# EAGLE design EFM_VCF3 (EAGLE 7.6.0)
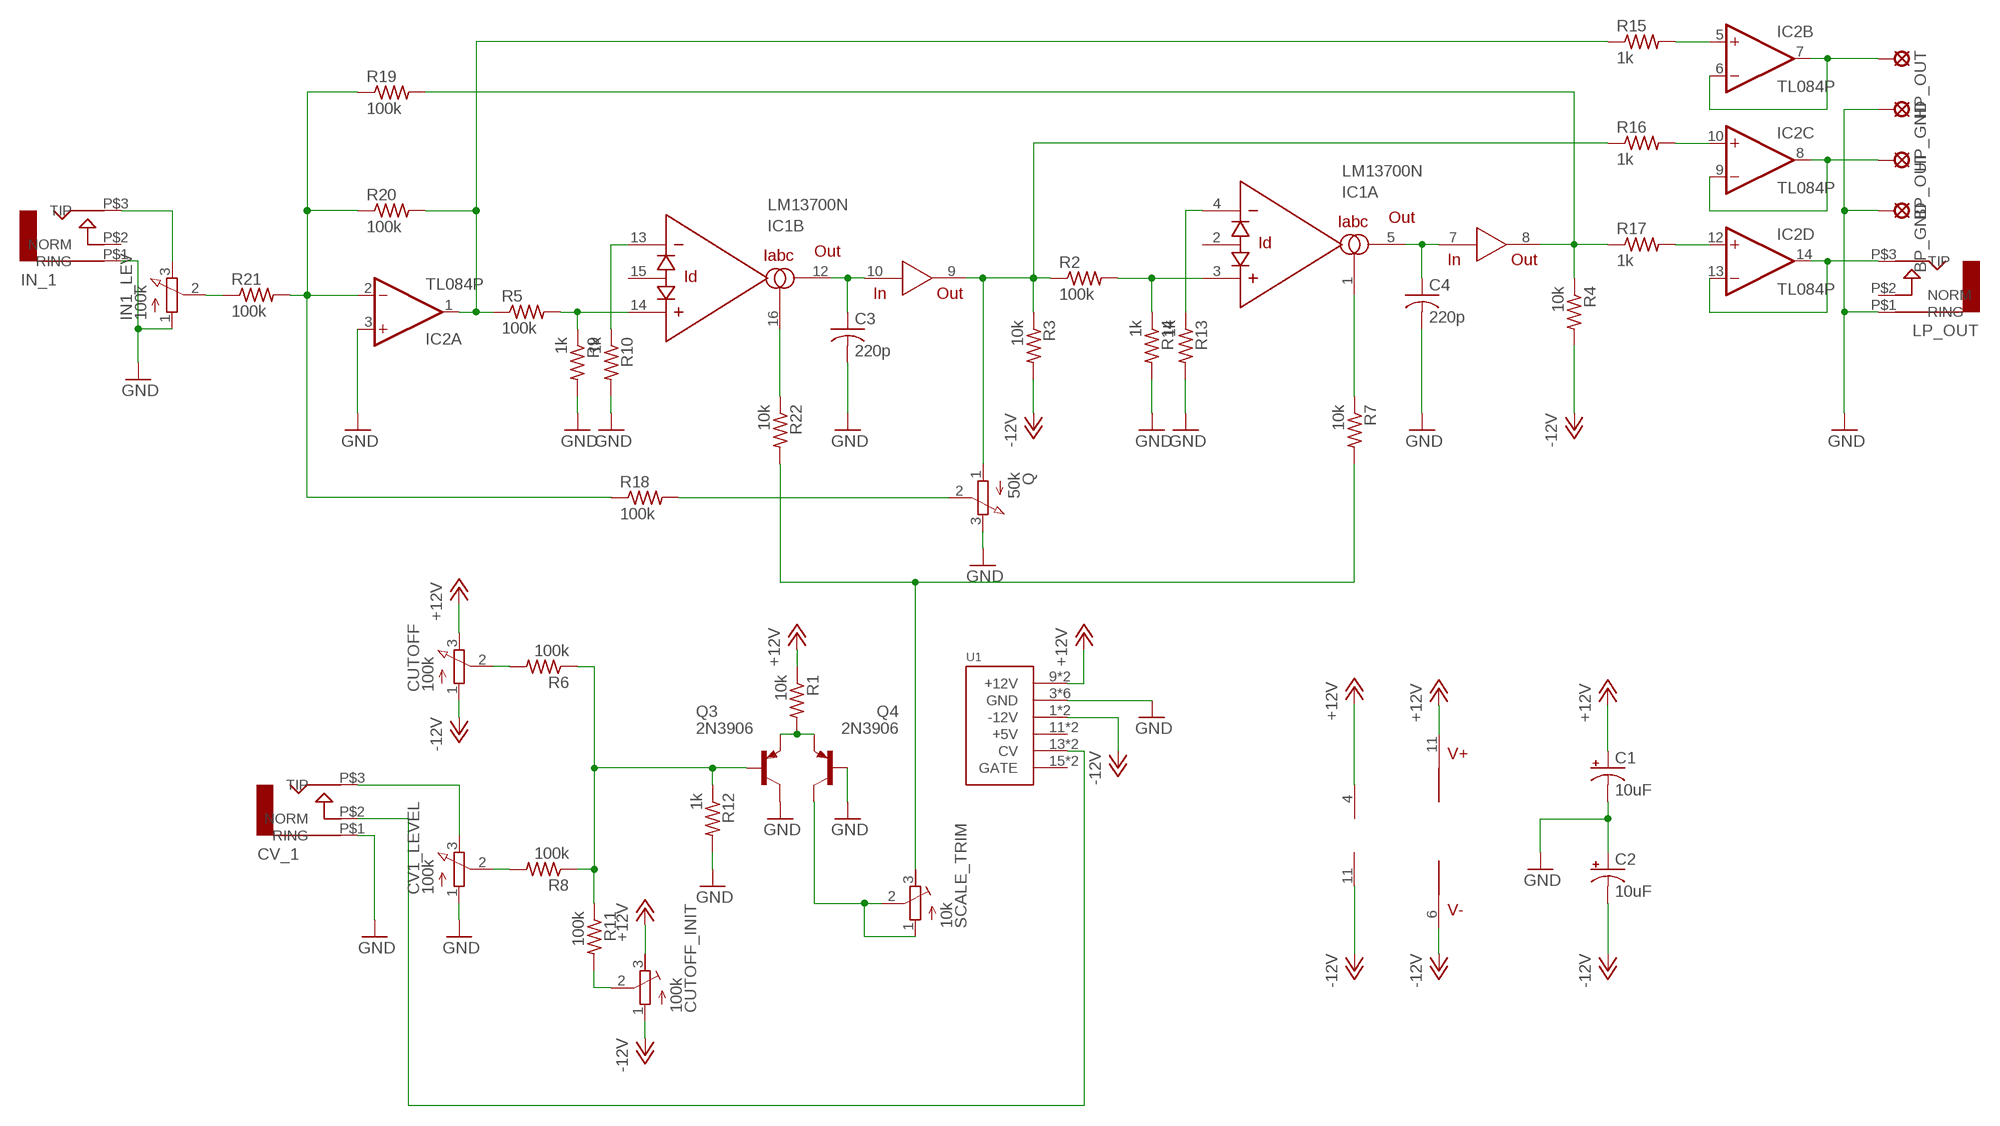
[diagram p0: schematic, sheet 1]

## Parts
BP_GND  LSP10  [LSP10]
BP_OUT  LSP10  [LSP10]
C1  10uF  CPOL-USB45181A  [B45181A]
C2  10uF  CPOL-USB45181A  [B45181A]
C3  220p  C-US075-032X103  [C075-032X103]
C4  220p  C-US075-032X103  [C075-032X103]
CUTOFF  100k  3RP/1610N  [3RP/1610N]
CUTOFF_INIT  100k  R-TRIMM64W  [RTRIM64W]
CV1_LEVEL  100k  3RP/1610N  [3RP/1610N]
CV_1  AUDIO-JACK  [ERTHENVAR-JACK-90DEG]
HP_GND  LSP10  [LSP10]
HP_OUT  LSP10  [LSP10]
IC1  LM13700N  [DIL16]
IC2  TL084P  [DIL14]
IN1_LEV  100k  3RP/1610N  [3RP/1610N]
IN_1  AUDIO-JACK  [ERTHENVAR-JACK-90DEG]
LP_OUT  AUDIO-JACK  [ERTHENVAR-JACK-90DEG]
Q  50k  3RP/1610N  [3RP/1610N]
Q3  2N3906  [TO92]
Q4  2N3906  [TO92]
R1  10k  R-US_0207/7  [0207/7]
R2  100k  R-US_0207/7  [0207/7]
R3  10k  R-US_0207/7  [0207/7]
R4  10k  R-US_0207/7  [0207/7]
R5  100k  R-US_0207/7  [0207/7]
R6  100k  R-US_0207/7  [0207/7]
R7  10k  R-US_0207/7  [0207/7]
R8  100k  R-US_0207/7  [0207/7]
R9  1k  R-US_0207/7  [0207/7]
R10  1k  R-US_0207/7  [0207/7]
R11  100k  R-US_0207/7  [0207/7]
R12  1k  R-US_0207/7  [0207/7]
R13  1k  R-US_0207/7  [0207/7]
R14  1k  R-US_0207/7  [0207/7]
R15  1k  R-US_0207/7  [0207/7]
R16  1k  R-US_0207/7  [0207/7]
R17  1k  R-US_0207/7  [0207/7]
R18  100k  R-US_0207/7  [0207/7]
R19  100k  R-US_0207/7  [0207/7]
R20  100k  R-US_0207/7  [0207/7]
R21  100k  R-US_0207/7  [0207/7]
R22  10k  R-US_0309/10  [0309/10]
SCALE_TRIM  10k  R-TRIMM64W  [RTRIM64W]
U1  POWER  [POWER_16]

## Nets
+12V: C1.+ CUTOFF.3(E) CUTOFF_INIT.3(E) IC1.11(V+) IC2.4(P:V+) R1.1 U1.9(+12V) U1.10(+12V)
-12V: C2.- CUTOFF.1(A) CUTOFF_INIT.1(A) IC1.6(V-) IC2.11(P:V-) R3.2 R4.2 U1.1(-12V) U1.2(-12V)
GND: BP_GND.MP C1.- C2.+ C3.2 C4.2 CV1_LEVEL.1(A) CV_1.P$1(RING) HP_GND.MP IC2.3(A:+IN) IN1_LEV.1(A) IN_1.P$1(RING) LP_OUT.P$1(RING) Q3.1(C) Q4.2(B) Q.3(E) R9.2 R10.2 R12.2 R13.2 R14.2 U1.3(GND) U1.4(GND) U1.5(GND) U1.6(GND) U1.7(GND) U1.8(GND)
N$1: Q3.3(E) Q4.3(E) R1.2
N$2: C3.1 IC1.10(IN) IC1.12(B:OUT)
N$3: C4.1 IC1.5(A:OUT) IC1.7(IN)
N$4: IC1.14(B:+IN) R5.2 R9.1
N$5: IC1.9(OUT) Q.1(A) R2.1 R3.1 R16.1
N$6: IC1.3(A:+IN) R2.2 R14.1
N$7: IC1.13(B:-IN) R10.1
N$8: IC1.4(A:-IN) R13.1
N$9: IC2.1(A:OUT) R5.1 R15.1 R20.2
N$10: CV1_LEVEL.2(S) R8.2
N$11: IC2.5(B:+IN) R15.2
N$12: IC2.10(C:+IN) R16.2
N$13: IC2.12(D:+IN) R17.2
N$14: IC2.13(D:-IN) IC2.14(D:OUT) LP_OUT.P$3(TIP)
N$15: BP_OUT.MP IC2.8(C:OUT) IC2.9(C:-IN)
N$16: IC1.1(A:IABC) R7.1
N$17: HP_OUT.MP IC2.6(B:-IN) IC2.7(B:OUT)
N$18: Q3.2(B) R6.1 R8.1 R11.1 R12.1
N$19: Q.2(S) R18.2
N$20: IC1.16(B:IABC) R22.1
N$21: R7.2 R22.2 SCALE_TRIM.3(E)
N$22: IN1_LEV.3(E) IN_1.P$3(TIP)
N$23: IC1.8(OUT) R4.1 R17.1 R19.2
N$24: IN1_LEV.2(S) R21.1
N$25: Q4.1(C) SCALE_TRIM.1(A) SCALE_TRIM.2(S)
N$26: IC2.2(A:-IN) R18.1 R19.1 R20.1 R21.2
N$27: CUTOFF_INIT.2(S) R11.2
N$54: CV1_LEVEL.3(E) CV_1.P$3(TIP)
N$55: CV_1.P$2(NORM) U1.13(CV) U1.14(CV)
N$56: CUTOFF.2(S) R6.2
Unconnected: IC1.2(A:ID) IC1.15(B:ID) IN_1.P$2(NORM) LP_OUT.P$2(NORM) U1.11(+5V) U1.12(+5V) U1.15(GATE) U1.16(GATE)

## Library data of the parts
BP_GND BP_OUT HP_GND HP_OUT = solpad:LSP10: SOLDER PAD drill 1.0 mm, distributor Buerklin, 12H555
C1 C2 = rcl:CPOL-US: POLARIZED CAPACITOR, American symbol
C3 C4 = rcl:C-US: CAPACITOR, American symbol
CUTOFF CV1_LEVEL IN1_LEV Q = pot:3RP/1610N: 16mm Potentiometer one level Source: http://www.alphapotentiometers.net/html/16mm_pot_2.html
CUTOFF_INIT SCALE_TRIM = rcl:R-TRIMM: Trimm resistor
CV_1 IN_1 LP_OUT = erthenvar:AUDIO-JACK: Switching Mono 3.5mm Audio Jack from Erthenvar.
IC1 = synthdiy updated imperial:LM13700: National Dual OTA with buffers.
IC2 = linear:TL084: OP AMP
Q3 Q4 = transistor-pnp:2N3906: PNP Transistor
R1-R22 = rcl:R-US_: RESISTOR, American symbol
U1 = eurorack:POWER

## Board
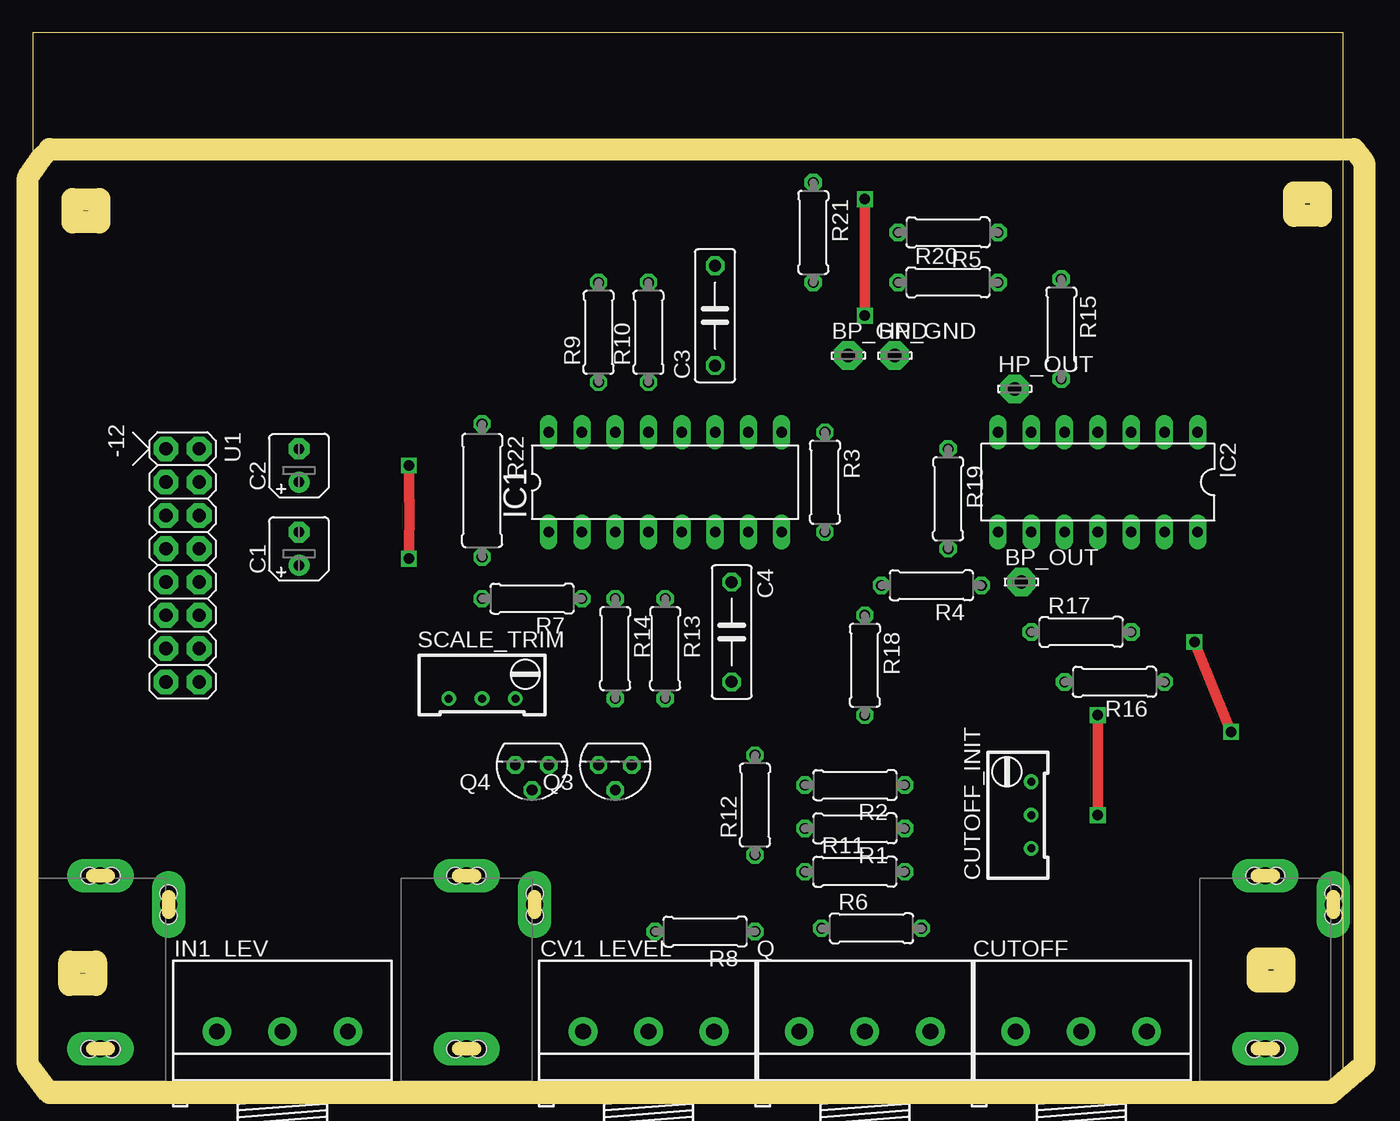
[diagram p1: board, top side]
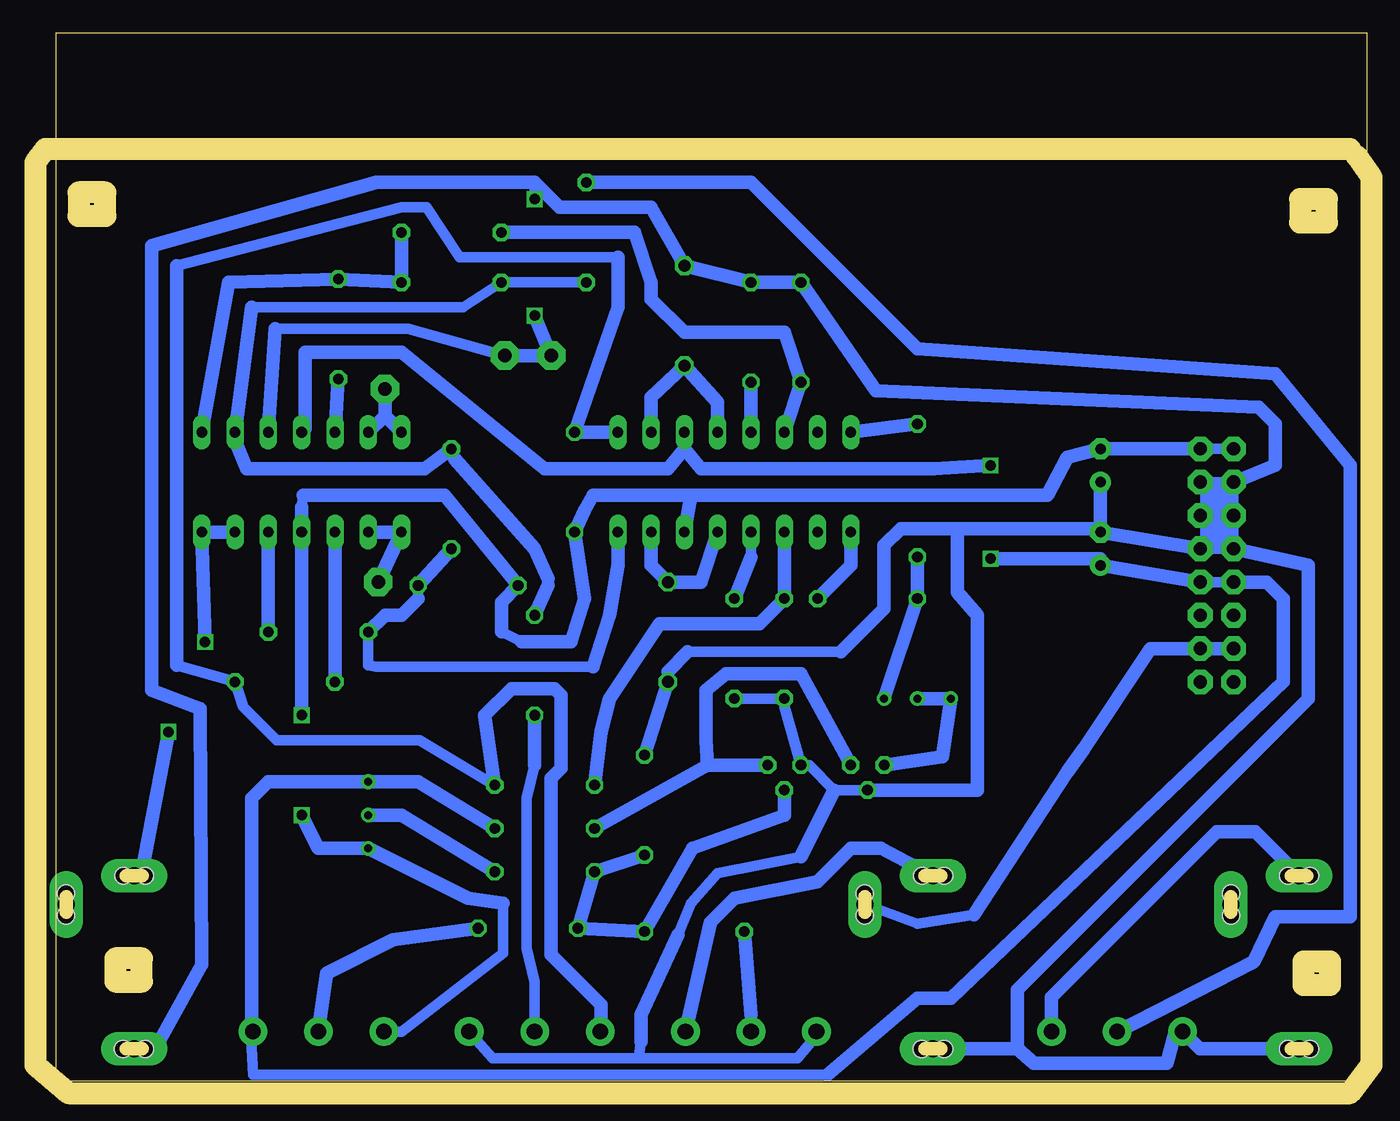
[diagram p2: board, bottom side, seen from below]

Size 100 x 80 mm. Coordinates in mm from the lower left corner, seen from the top.
Outline: 0,0 100,0 100,80 0,80 0,0
Copper layers (1*16): Top 0.035mm / dielectric 1.5mm / Bottom 0.035mm
Design rules "default *": minimum track width 28mil, minimum drill 31mil, track to track 16mil, track to pad 16mil, pad to pad 16mil, via to via 16mil, smd to smd 8mil, copper to edge 0mil, drill to drill 16mil, minimum pad ring 10mil, minimum via ring 8mil, stop-mask expansion 4mil, vias tented up to drill 0mil, thermal gap 10mil
Milling: 24 lines

### Footprints (pad centres in the part's own frame; a part is rotated, then mirrored left to right if it is on the bottom)
LSP10 = drill 1.016 pad 2.159 octagon: MP 0,0
B45181A = drill 0.813 pad 1.6: + -1.27,0 | drill 0.813 pad 1.6 octagon: - 1.27,0
C075-032X103 = drill 0.914 octagon: 1 -3.81,0; 2 3.81,0
3RP/1610N = drill 1.2 pad 2.184: 1 -5,0; 2 0,0; 3 5,0
RTRIM64W = drill 0.61: 1 1.27,-2.54; 2 1.27,0; 3 1.27,2.54
ERTHENVAR-JACK-90DEG = drill 1.3 pad 2.54 long: P$1 5,-2.5; P$2 -0.2,-13.5; P$3 5,-15.7 | hole 1.3: 5.842,-2.489; 4.14,-2.489; -0.203,-12.649; -0.203,-14.351; 5.842,-15.697; 4.166,-15.697
DIL16 = drill 0.813 long: 1 -8.89,-3.81; 2 -6.35,-3.81; 3 -3.81,-3.81; 4 -1.27,-3.81; 5 1.27,-3.81; 6 3.81,-3.81; 7 6.35,-3.81; 8 8.89,-3.81; 9 8.89,3.81; 10 6.35,3.81; 11 3.81,3.81; 12 1.27,3.81; 13 -1.27,3.81; 14 -3.81,3.81; 15 -6.35,3.81; 16 -8.89,3.81
DIL14 = drill 0.813 long: 1 -7.62,-3.81; 2 -5.08,-3.81; 3 -2.54,-3.81; 4 0,-3.81; 5 2.54,-3.81; 6 5.08,-3.81; 7 7.62,-3.81; 8 7.62,3.81; 9 5.08,3.81; 10 2.54,3.81; 11 0,3.81; 12 -2.54,3.81; 13 -5.08,3.81; 14 -7.62,3.81
TO92 = drill 0.813 octagon: 1 1.27,0; 2 0,1.905; 3 -1.27,0
0207/7 = drill 0.813 octagon: 1 -3.81,0; 2 3.81,0
0309/10 = drill 0.813 octagon: 1 -5.08,0; 2 5.08,0
POWER_16 = drill 1.016 pad 1.88 octagon: 1 -6.35,-1.27; 2 -6.35,1.27; 3 -3.81,-1.27; 4 -3.81,1.27; 5 -1.27,-1.27; 6 -1.27,1.27; 7 1.27,-1.27; 8 1.27,1.27; 9 3.81,-1.27; 10 3.81,1.27; 11 6.35,-1.27; 12 6.35,1.27; 13 8.89,-1.27; 14 8.89,1.27; 15 11.43,-1.27; 16 11.43,1.27

### Placement (x,y rotation side)
BP_GND  62.23,55.37 0 top
BP_OUT  75.44,38.1 0 top
C1  20.32,40.64 90 top
C2  20.32,46.99 90 top
C3  52.07,58.42 90 top
C4  53.34,34.29 270 top
CUTOFF  80.01,3.81 0 top
CUTOFF_INIT  74.93,20.32 0 top
CV1_LEVEL  46.99,3.81 0 top
CV_1  38.1,0 180 top
HP_GND  65.79,55.37 0 top
HP_OUT  74.93,52.83 0 top
IC1  48.26,45.72 0 top
IC2  81.28,45.72 180 top
IN1_LEV  19.05,3.81 0 top
IN_1  10.16,0 180 top
LP_OUT  99.06,0 180 top
Q  63.5,3.81 0 top
Q3  44.45,24.13 180 top
Q4  38.1,24.13 180 top
R1  62.74,19.3 180 top
R2  62.74,22.61 180 top
R3  60.45,45.72 270 top
R4  68.58,37.85 180 top
R5  69.85,64.77 180 top
R6  64.01,11.68 0 top
R7  38.1,36.83 180 top
R8  51.31,11.43 180 top
R9  43.18,57.15 90 top
R10  46.99,57.15 90 top
R11  62.74,16 0 top
R12  55.12,21.08 90 top
R13  48.26,33.02 270 top
R14  44.45,33.02 270 top
R15  78.49,57.4 270 top
R16  82.55,30.48 180 top
R17  80.01,34.29 0 top
R18  63.5,31.75 270 top
R19  69.85,44.45 270 top
R20  69.85,60.96 0 top
R21  59.56,64.77 270 top
R22  34.29,45.09 270 top
SCALE_TRIM  34.29,30.48 270 top
U1  11.43,41.91 270 top

### Tracks (layer width: path | path; a pad name or v marks a point on that pad's centre or on a via)
+12V  (via drill 0.8)
  Top 0.813: v28.7,39.88 28.74,44.26 28.7,44.29 v28.7,46.99
  Bottom 0.813: 85.09,3.89 CUTOFF.3 85.09,3.73 85.09,2.54 84.96,0.51 41.15,0.51 | U1.9 U1.10 | C1.+ 20.32,39.88 | 81.03,49.78 IC2.4 | IC1.11 52.07,48.26
  Bottom 1.016: R1.1 72.39,22.86 CUTOFF_INIT.3 83.82,22.86 85.09,21.59 85.09,3.89 | U1.10 C1.+ | 41.15,0.51 34.29,6.35 31.75,6.35 6.35,30.48 6.35,36.83 7.62,38.1 U1.9 | v28.7,39.88 20.32,39.88 | 81.03,49.78 81.03,55.63 73.66,55.63 62.74,46.74 53.34,46.74 52.07,48.26 50.8,46.74 33.02,46.74 v28.7,46.99
-12V  (via drill 0.8)
  Top 0.813: v81.28,20.32 v81.28,27.94
  Bottom 0.813: U1.1 U1.2 | 66.04,34.29 64.52,33.53 | 81.15,44.7 81.28,43.81 | 75.01,3.73 CUTOFF.1 73.66,3.81 65.91,9.78 65.91,13.59
  Bottom 1.016: U1.2 C2.- 22.86,47.62 24.38,44.7 51.56,44.7 | 51.56,44.7 IC1.6 | 51.56,44.7 59.05,44.7 59.69,43.56 R3.2 59.69,36.83 60.71,33.53 64.52,33.53 | 81.15,44.7 70.36,44.7 R4.2 66.04,36.58 66.04,34.29 | 81.28,43.81 IC2.11 v81.28,27.94 | 65.91,13.59 68.58,13.97 CUTOFF_INIT.1 80.01,17.78 v81.28,20.32
GND  (via drill 0.8)  (1 unrouted)
  Top 0.813: v63.5,58.42 v63.5,67.31
  Bottom 0.711: 44.45,28.57 R14.2 | U1.7 U1.5 U1.3 | 14.61,3.81 IN1_LEV.1
  Bottom 0.813: R13.2 R14.2 | 42.55,3.81 CV1_LEVEL.1 41.99,3.48 43.43,1.78 54.8,1.78 55.57,1.78 | HP_GND.MP 73.15,57.4 83.31,57.4 | U1.4 U1.3 | U1.7 U1.8 | U1.5 U1.6 | 44.45,28.57 Q3.1 42.55,24.13 40.64,22.23 Q4.2 | 32.98,2.5 33.02,2.54 | LP_OUT.P$1 94.06,2.62 92.08,3.17 | 43.18,17.14 49.53,15.88 51.56,13.59 52.58,11.18 | 55.37,3.05 55.57,1.78 | 55.57,1.78 56.39,1.78 66.72,1.78 Q.3 | C4.2 53.34,31.24 | 51.82,32.77 40.13,32.77 | v63.5,67.31 63.5,68.58 | 20.57,42.16 C1.-
  Bottom 1.016: C4.2 R12.2 | C2.+ C1.- U1.8 | 83.31,57.4 IC2.3 | HP_GND.MP BP_GND.MP v63.5,58.42 | 14.61,3.81 15.24,1.4 25.4,1.4 26.67,2.5 | 26.67,2.5 26.67,6.99 4.45,29.21 4.45,39.37 U1.7 | U1.3 6.99,46.99 6.99,50.16 8.26,51.44 37.47,52.7 R9.2 R10.2 C3.2 54.61,66.67 61.59,66.67 63.5,68.58 75.56,68.58 92.71,63.75 92.71,29.84 89.03,28.45 88.9,8.89 92.08,3.17 | IN_1.P$1 12.74,2.5 IN1_LEV.1 | 26.67,2.5 32.98,2.5 | Q4.2 29.72,22.23 29.72,35.56 31.24,37.34 31.24,42.16 | 43.18,17.14 40.64,22.23 | 52.58,11.18 55.37,5.08 55.37,3.05 | 53.34,31.24 51.82,32.77 | 40.13,32.77 36.83,36.07 36.83,40.89 35.56,42.16 31.24,42.16 | 31.24,42.16 20.57,42.16
N$1
  Bottom 1.016: R1.2 50.29,24.13 | 50.29,24.13 Q3.3 | Q4.3 43.18,31.11 48.9,31.11 50.42,29.84 50.42,26.04 50.29,24.13
N$2
  Bottom 1.016: IC1.12 49.53,51.82 C3.1 54.61,52.2 IC1.10
N$3
  Bottom 1.016: IC1.5 50.8,38.1 C4.1 54.61,39.37 IC1.7
N$4
  Bottom 1.016: IC1.14 R9.1 44.45,57.15 52.07,57.15 54.61,59.69 54.61,60.96 55.88,64.77 R5.2
N$5
  Bottom 0.813: R2.1 72.26,26.04 83.19,26.04 85.72,28.57 R16.1 90.81,31.75 | 57.15,62.87 69.22,62.87 71.75,66.67 73.66,66.67 90.81,62.23 | 58.42,3.89 Q.1
  Bottom 1.016: IC1.9 R3.1 57.15,59.05 57.15,62.87 | 90.81,31.75 90.81,62.23 | R2.1 67.31,27.94 65.28,29.97 61.98,29.97 61.47,29.46 61.47,23.88 62.23,23.11 62.23,9.65 58.42,5.84 58.42,3.89
N$6
  Bottom 1.016: IC1.3 R14.1 46.35,34.92 53.98,34.92 57.78,29.21 58.42,26.67 R2.2
N$7
  Bottom 1.016: R10.1 IC1.13
N$8
  Bottom 0.813: IC1.4 46.99,40.01
  Bottom 1.016: 46.99,40.01 R13.1
N$9
  Bottom 1.016: R5.1 R20.2 R15.1 86.87,60.96 IC2.1
N$10
  Bottom 0.813: CV1_LEVEL.2 46.99,5.08
  Bottom 1.016: 46.99,5.08 R8.2
N$11
  Bottom 1.016: R15.2 IC2.5
N$12
  Bottom 1.016: IC2.10 R16.2
N$13
  Bottom 1.016: IC2.12 R17.2
N$14  (via drill 0.8)
  Top 0.813: v91.44,26.67 v88.65,33.53
  Bottom 0.813: LP_OUT.P$3 93.52,15.7
  Bottom 1.016: IC2.13 IC2.14 v88.65,33.53 | 93.52,15.7 v91.44,26.67
N$15
  Bottom 1.016: IC2.9 IC2.8 BP_OUT.MP
N$16
  Bottom 1.016: IC1.1 39.37,39.37 R7.1
N$17
  Bottom 1.016: IC2.6 74.93,50.8 | 74.93,50.8 IC2.7 | HP_OUT.MP 74.93,50.8
N$18
  Bottom 1.016: Q3.2 44.45,20.32 51.44,17.78 R8.1 R6.1 R11.1 R12.1
N$19
  Bottom 0.813: Q.2 63.5,7.62 64.14,10.16 64.14,21.59 63.5,24.13
  Bottom 1.016: 63.5,24.13 R18.2
N$20
  Bottom 1.016: IC1.16 R22.1
N$21
  Bottom 1.016: SCALE_TRIM.3 R7.2 R22.2
N$22
  Bottom 1.016: IN1_LEV.3 24.05,6.43 11.43,19.05 8.51,19.05 IN_1.P$3
N$23
  Bottom 0.813: 59.05,31.62 75.56,31.62 76.2,31.75 R17.1 | R4.1 72.39,36.83
  Bottom 1.016: IC1.8 57.15,39.37 57.78,35.56 59.05,31.62 | R19.2 R4.1 | 72.39,36.83 73.66,35.56 74.93,35.56 R17.1
N$24
  Bottom 1.016: R21.1 46.99,68.58 34.29,55.88 6.99,53.98 1.27,46.99 1.27,12.57 6.99,12.57 8.64,9.14 IN1_LEV.2
N$25
  Bottom 1.016: SCALE_TRIM.2 SCALE_TRIM.1 32.38,24.77 Q4.1
N$26
  Bottom 0.711: IC2.2 86.36,48.9
  Bottom 0.813: 85.09,59.05 68.96,59.05 R20.1 R21.2 | R19.1 69.6,47.5 | 62.48,38.35 62.48,37.85
  Bottom 1.016: 85.09,59.05 IC2.2 | 86.36,48.9 85.47,46.74 71.88,46.74 R19.1 | 69.6,47.5 63.5,40.64 62.48,38.35 | 62.48,37.85 R18.1
N$27
  Bottom 1.016: R11.2 73.66,20.32 CUTOFF_INIT.2
N$54
  Bottom 1.016: CV1_LEVEL.3 50.09,12.14 48.26,13.97 41.91,15.24 39.37,17.78 37.09,17.78 CV_1.P$3
N$55
  Bottom 0.813: 29.97,12.7 34.29,12.03 CV_1.P$2
  Bottom 1.016: U1.13 U1.14 16.51,33.02 21.59,25.4 22.86,23.62 29.97,12.7
N$56
  Bottom 1.016: R6.2 74.3,10.79 79.38,8.26 CUTOFF.2
(copper drawn outside any net)
  shapes: Bottom area x1